# EasyEDA schematic NFC名片_2021-03-03.json
TITLE: NFC电子名片; REV: 1.0; Date: 2021-02-24; Sheet: 1/1; Drawn By: Kenn; Company: Kenn Zhang
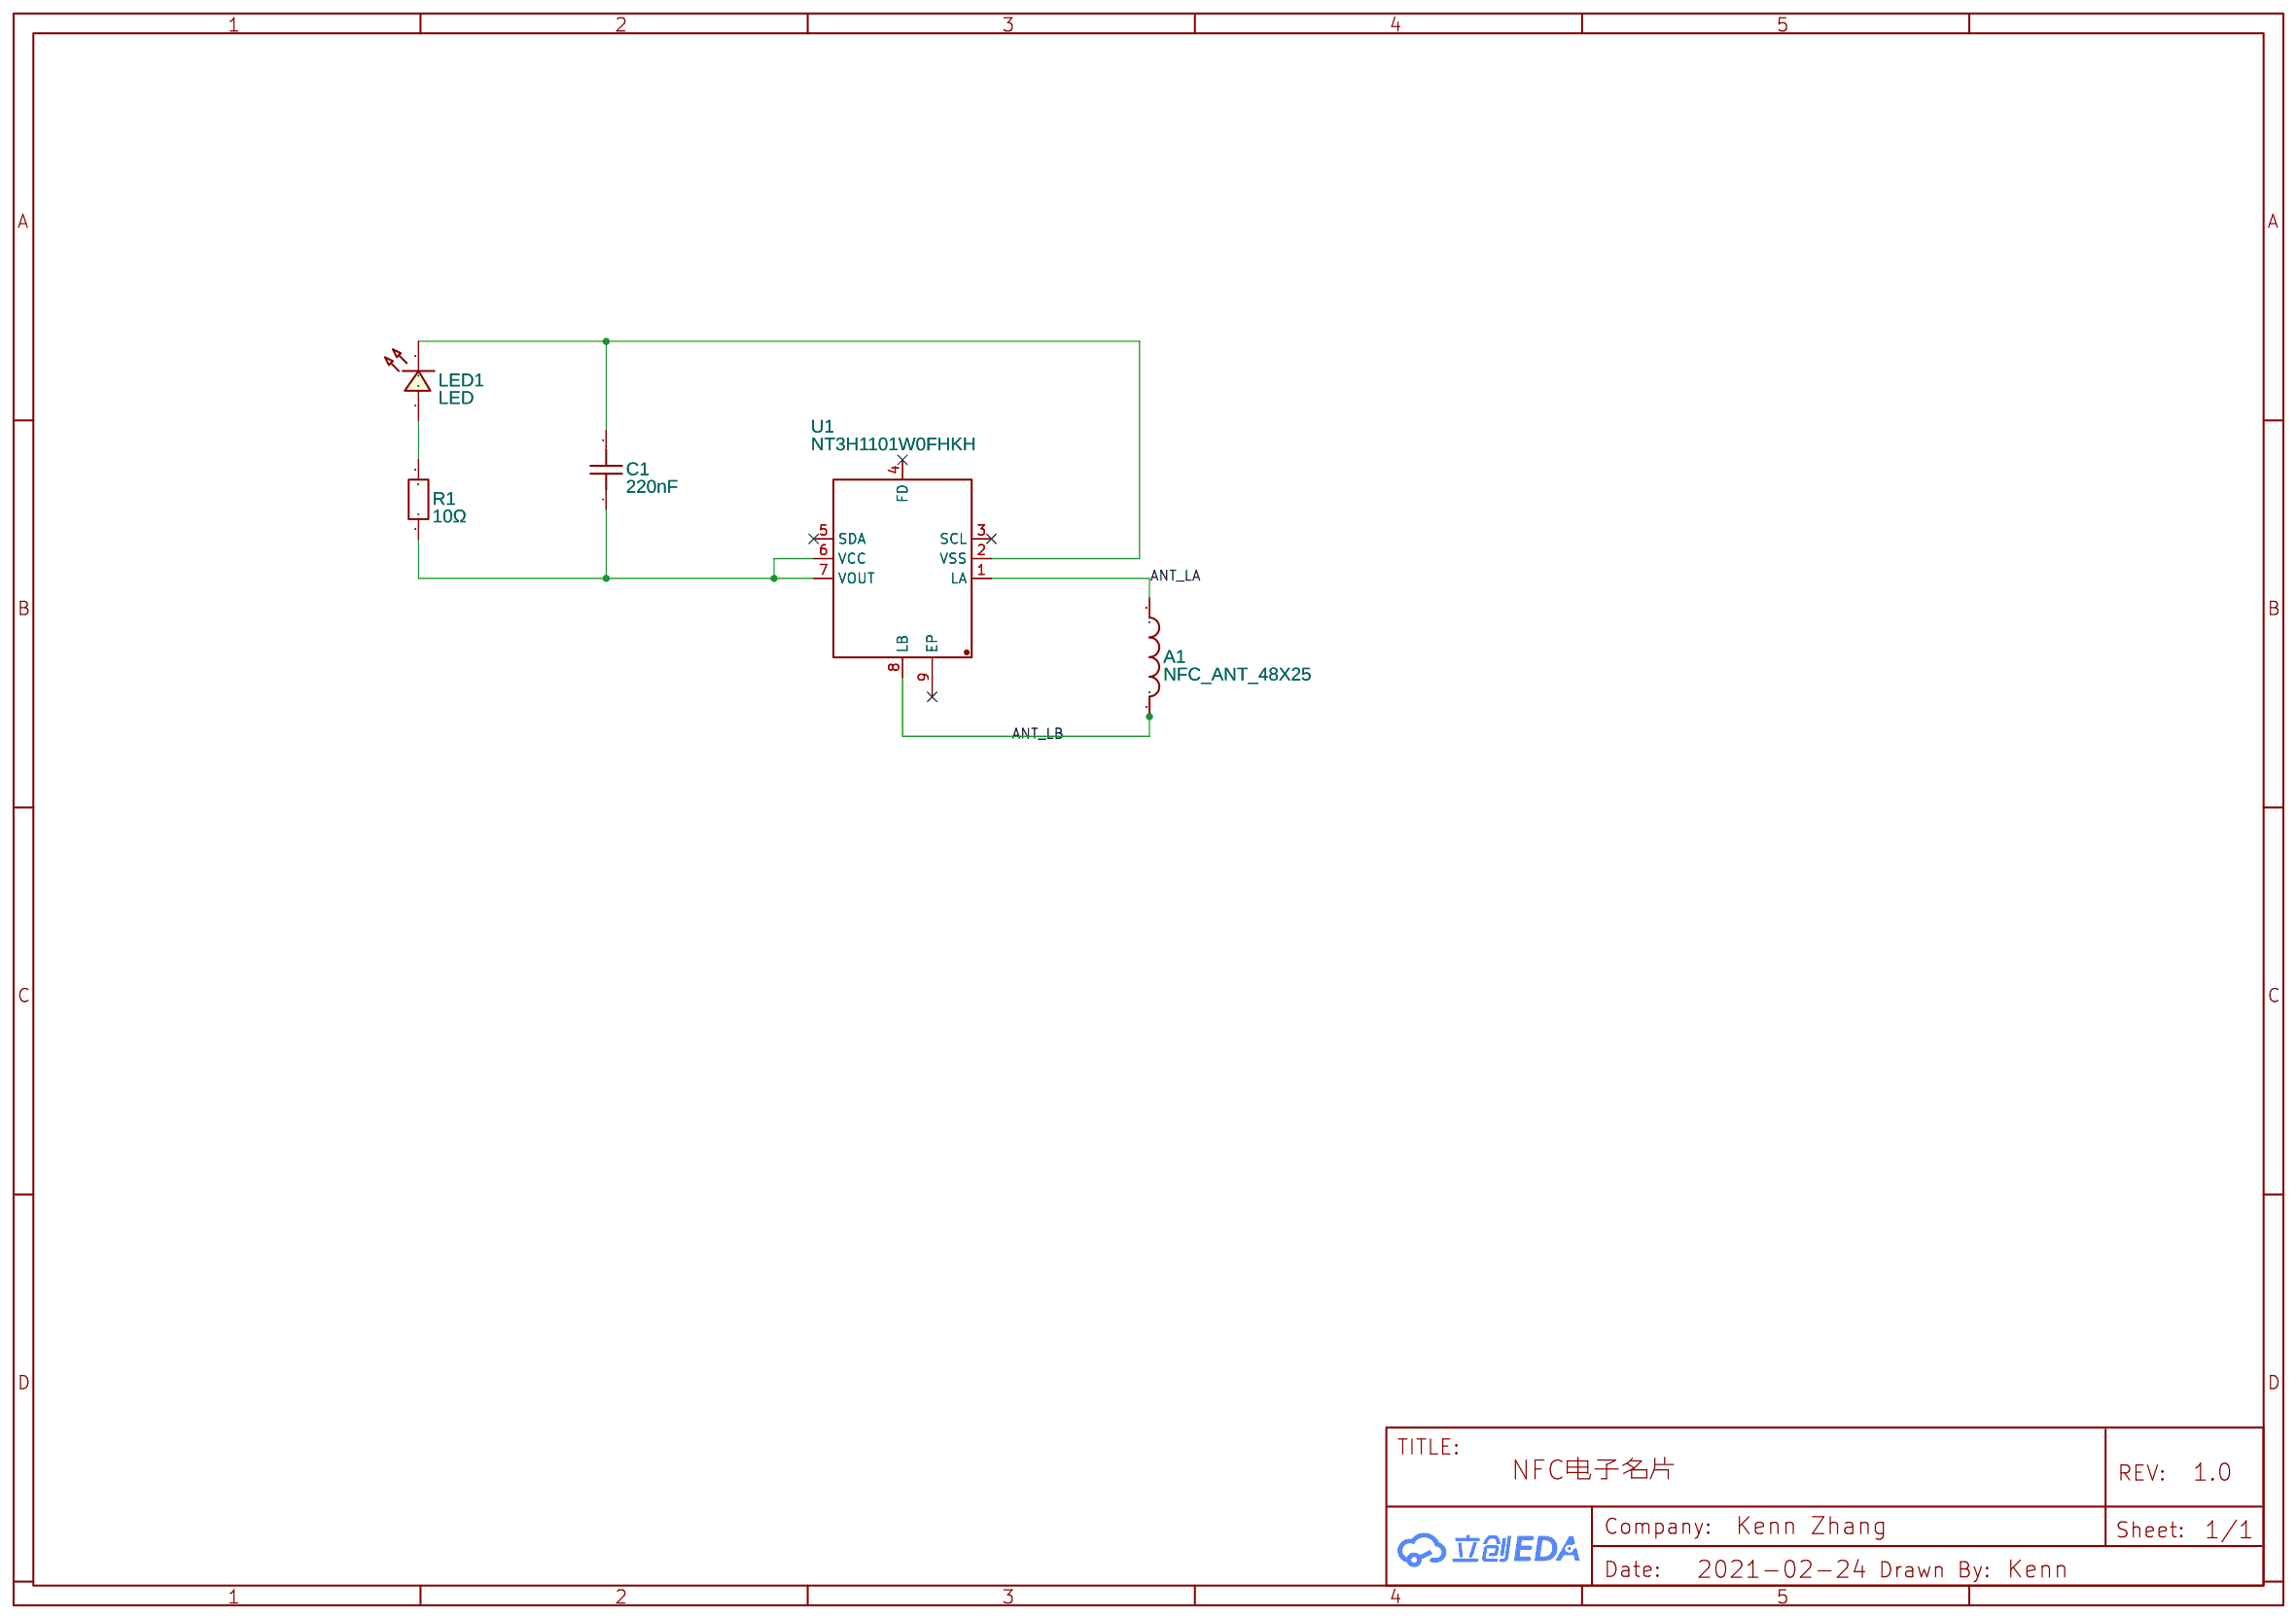
[diagram p0: schematic sheet]

## Parts
A1  NFC_ANT_48X25  [NFC_ANT_48X25]
C1  220nF  [C0603]
LED1  LED  [LED0603_BLUE]
R1  10Ω  [R0603]
U1  NT3H1101W0FHKH  [XQFN-8_L1.6-W1.6-P0.50-BR]

## Library data of the parts
A1 = NFC_ANT_48X25: Contributor: elio1997
C1 = C_0603_US: Supplier Part: C338153; Supplier: LCSC; Contributor: LCEDA_Lib; Manufacturer Part: 0603B224K160CT; Manufacturer: 华新科(Walsin)
LED1 = LED-0603_R: Manufacturer: 国星光电; Manufacturer Part: NCD0603G2; Supplier Part: C87326; Supplier: LCSC; Contributor: LCEDA_01
R1 = R_0603_EU: Supplier Part: C22859; Supplier: LCSC; Contributor: LCEDA_Lib; Manufacturer Part: 0603WAF100JT5E; Manufacturer: UNI-ROYAL(厚声)
U1 = NT3H1101W0FHKH: Supplier: LCSC; Supplier Part: C73156; Manufacturer: NXP Semicon; Contributor: LCSC; SMT Type: Extend; JLCPCB SMD: Yes; Paste Type: expand; Assembly Type: smtWeld

## Nets
ANT_LA: A1.A U1.1(LA)
ANT_LB: A1.B A1.P$3(B) U1.8(LB)
Net-(C1-1): C1.1 R1.1 U1.6(VCC) U1.7(VOUT)
Net-(C1-2): C1.2 LED1.2 U1.2(VSS)
Net-(LED1-1): LED1.1 R1.2

Not connected (* = marked no-connect by the designer): U1 3(SCL)* 4(FD)* 5(SDA)* 9(EP)*
